# EAGLE design terraço_verde_placa_perfurada_sem_pluviometro (EAGLE 9.5.1)
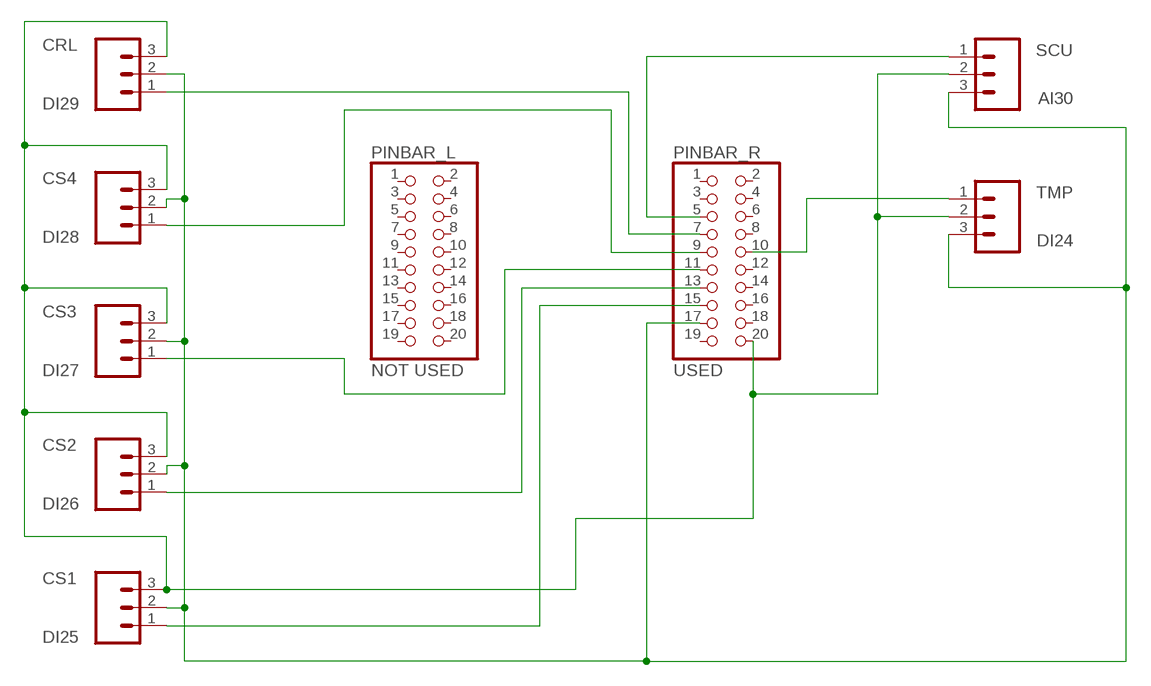
[diagram p0: schematic, sheet 1]

## Parts
CRL  DI29  M03  [03P]
CS1  DI25  M03  [03P]
CS2  DI26  M03  [03P]
CS3  DI27  M03  [03P]
CS4  DI28  M03  [03P]
PINBAR_L  NOT USED  PINHD-2X10  [2X10]
PINBAR_R  USED  PINHD-2X10  [2X10]
SCU  AI30  M03  [03P]
TMP  DI24  M03  [03P]

## Nets
N$1: PINBAR_R.5 SCU.1
N$2: CRL.1 PINBAR_R.7
N$3: CS4.1 PINBAR_R.9
N$4: CS3.1 PINBAR_R.11
N$5: CS2.1 PINBAR_R.13
N$6: CS1.1 PINBAR_R.15
N$7: PINBAR_R.10 TMP.1
N$10: CRL.2 CS1.2 CS2.2 CS3.2 CS4.2 PINBAR_R.17 SCU.3 TMP.3
N$11: CRL.3 CS1.3 CS2.3 CS3.3 CS4.3 PINBAR_R.20 SCU.2 TMP.2
Unconnected: PINBAR_L.1 PINBAR_L.2 PINBAR_L.3 PINBAR_L.4 PINBAR_L.5 PINBAR_L.6 PINBAR_L.7 PINBAR_L.8 PINBAR_L.9 PINBAR_L.10 PINBAR_L.11 PINBAR_L.12 PINBAR_L.13 PINBAR_L.14 PINBAR_L.15 PINBAR_L.16 PINBAR_L.17 PINBAR_L.18 PINBAR_L.19 PINBAR_L.20 PINBAR_R.1 PINBAR_R.2 PINBAR_R.3 PINBAR_R.4 PINBAR_R.6 PINBAR_R.8 PINBAR_R.12 PINBAR_R.14 PINBAR_R.16 PINBAR_R.18 PINBAR_R.19

## Library data of the parts
CRL CS1-CS4 SCU TMP = con-amp-quick:M03: AMP QUICK CONNECTOR; OC_FARNELL: unknown; OC_NEWARK: unknown
PINBAR_L PINBAR_R = pinhead:PINHD-2X10: PIN HEADER

## Board
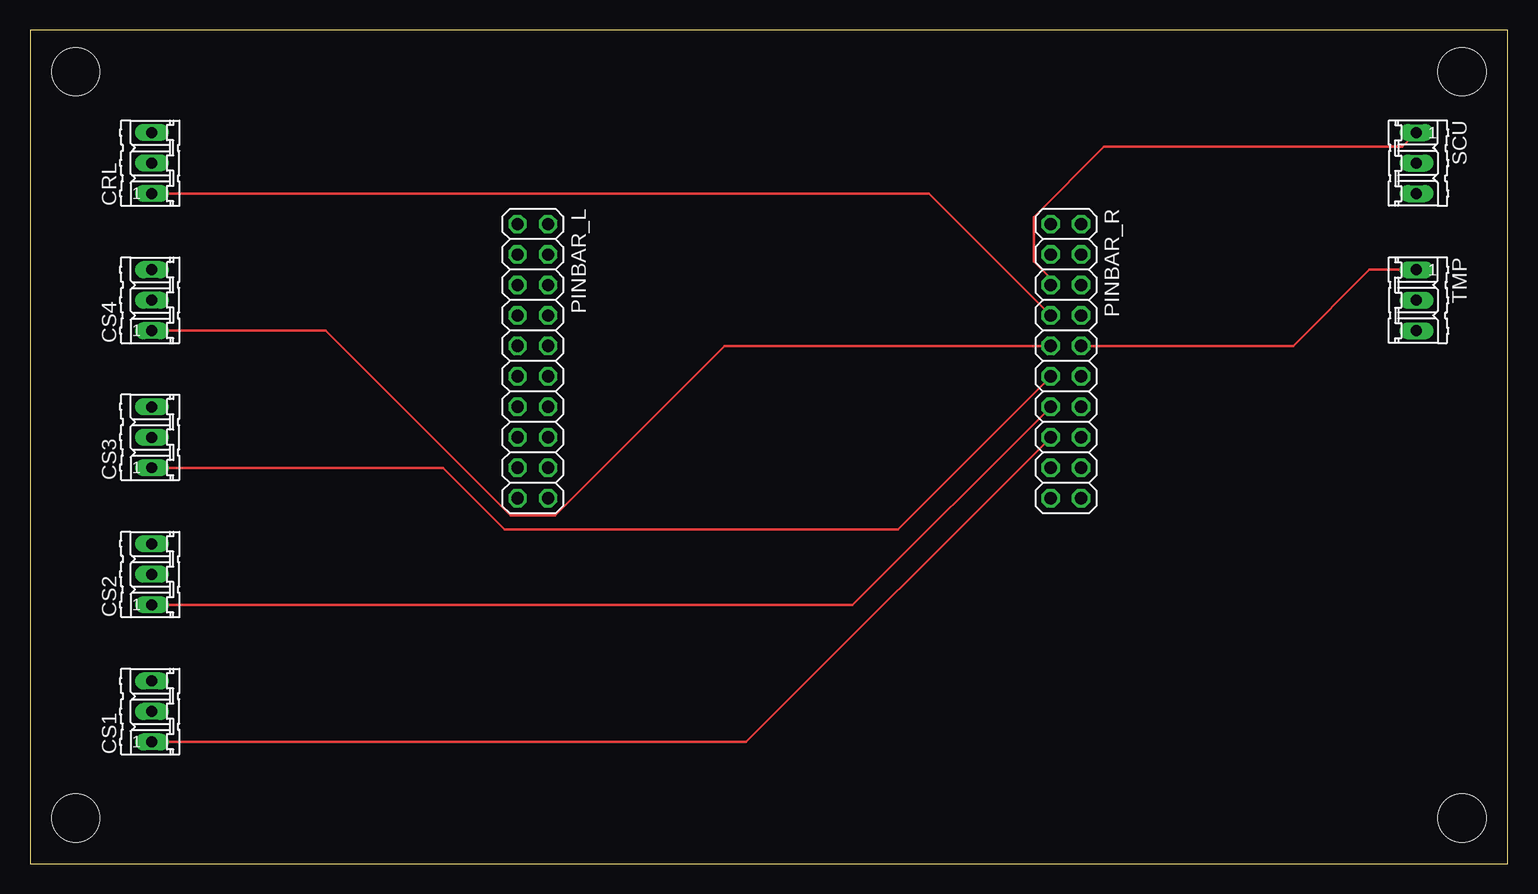
[diagram p1: board, top side]
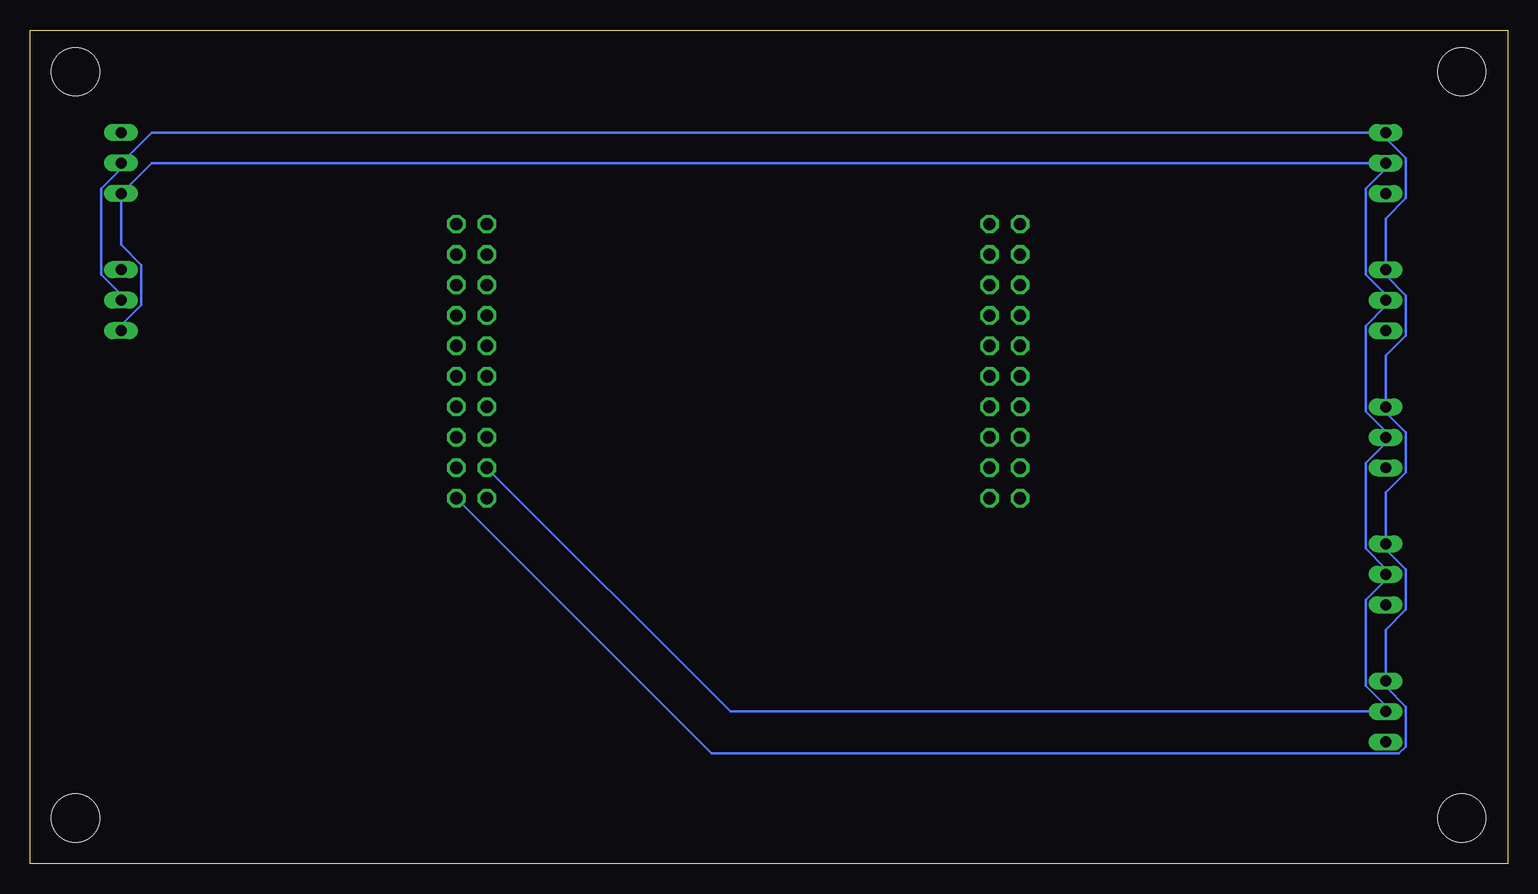
[diagram p2: board, bottom side, seen from below]

Size 123.17 x 69.52 mm. Coordinates in mm from the lower left corner, seen from the top.
Outline: 0,0 123.17,0 123.17,69.52 0,69.52 0,0
Copper layers (1*16): Top 0.035mm / dielectric 1.5mm / Bottom 0.035mm
Design rules "default": minimum track width 6mil, minimum drill 0.35mm, track to track 6mil, track to pad 6mil, pad to pad 6mil, via to via 6mil, smd to smd 6mil, copper to edge 40mil, drill to drill 6mil, minimum pad ring 10mil, minimum via ring 8mil, stop-mask expansion 4mil, vias tented up to drill 0mil, thermal gap 10mil
Holes 4 mm at 119.38,66.04 119.38,3.81 3.81,3.81 3.81,66.04

### Footprints (pad centres in the part's own frame; a part is rotated, then mirrored left to right if it is on the bottom)
03P = drill 0.914 long: 1 -2.54,0; 2 0,0; 3 2.54,0
2X10 = drill 1.016 octagon: 1 -11.43,-1.27; 2 -11.43,1.27; 3 -8.89,-1.27; 4 -8.89,1.27; 5 -6.35,-1.27; 6 -6.35,1.27; 7 -3.81,-1.27; 8 -3.81,1.27; 9 -1.27,-1.27; 10 -1.27,1.27; 11 1.27,-1.27; 12 1.27,1.27; 13 3.81,-1.27; 14 3.81,1.27; 15 6.35,-1.27; 16 6.35,1.27; 17 8.89,-1.27; 18 8.89,1.27; 19 11.43,-1.27; 20 11.43,1.27

### Placement (x,y rotation side)
CRL  10.16,58.42 90 top
CS1  10.16,12.7 90 top
CS2  10.16,24.13 90 top
CS3  10.16,35.56 90 top
CS4  10.16,46.99 90 top
PINBAR_L  41.91,41.91 270 top
PINBAR_R  86.36,41.91 270 top
SCU  115.57,58.42 270 top
TMP  115.57,46.99 270 top

### Tracks (layer width: path | path; a pad name or v marks a point on that pad's centre or on a via)
N$1
  Top 0.203: SCU.1 114.4,59.79 89.53,59.79 83.67,53.93 83.67,50.21 85.09,48.79 PINBAR_R.5
N$2
  Top 0.203: PINBAR_R.7 74.93,55.88 CRL.1
N$3
  Top 0.203: CS4.1 24.66,44.45 40.05,29.06 43.77,29.06 57.89,43.18 PINBAR_R.9
N$4
  Top 0.203: CS3.1 34.44,33.02 39.57,27.89 72.34,27.89 PINBAR_R.11
N$5
  Top 0.203: CS2.1 68.58,21.59 PINBAR_R.13
N$6
  Top 0.203: PINBAR_R.15 59.69,10.16 CS1.1
N$7
  Top 0.203: TMP.1 111.65,49.53 105.3,43.18 PINBAR_R.10
N$10
  Bottom 0.203: PINBAR_R.17 64.77,12.7 CS1.2 10.16,13.16 11.84,14.84 11.84,21.99 10.16,23.67 CS2.2 10.16,24.59 11.84,26.27 11.84,33.42 10.16,35.1 CS3.2 10.16,36.02 11.84,37.7 11.84,44.85 10.16,46.53 CS4.2 10.16,47.45 11.84,49.13 11.84,56.28 10.16,57.96 CRL.2 113.03,58.42 SCU.3 115.57,51.61 113.89,49.93 113.89,46.59 115.57,44.91 TMP.3
N$11
  Bottom 0.203: PINBAR_R.20 66.34,9.19 9.05,9.19 8.48,9.76 8.48,13.1 10.16,14.78 CS1.3 10.16,19.51 8.48,21.19 8.48,24.53 10.16,26.21 CS2.3 10.16,30.94 8.48,32.62 8.48,35.96 10.16,37.64 CS3.3 10.16,42.37 8.48,44.05 8.48,47.39 10.16,49.07 CS4.3 10.16,53.8 8.48,55.48 8.48,58.82 10.16,60.5 CRL.3 113.03,60.96 SCU.2 115.57,57.96 117.25,56.28 117.25,49.13 115.57,47.45 TMP.2